# EAGLE design bltthBoard (EAGLE 6.4)
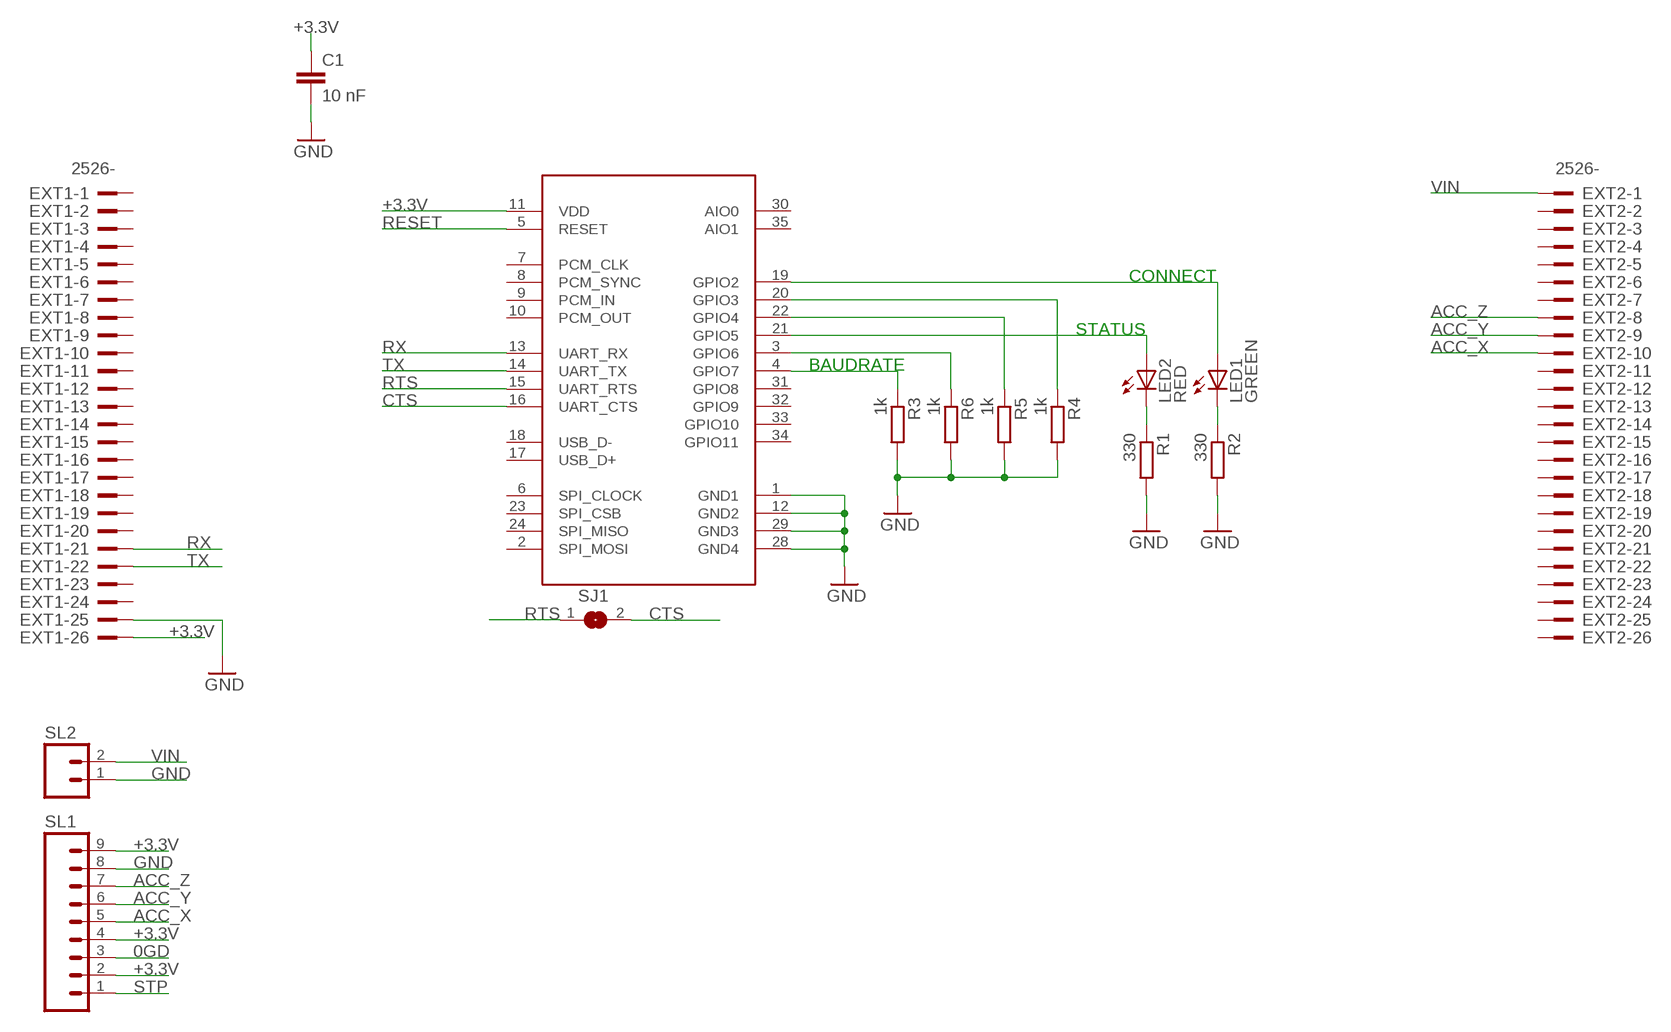
[diagram p0: schematic, sheet 1]

## Parts
C1  10 nF  C-EUC0402  [C0402]
EXT1  2526-  [PAK100/2500-26]
EXT2  2526-  [PAK100/2500-26]
LED1  GREEN  LEDCHIP-LED0805  [CHIP-LED0805]
LED2  RED  LEDCHIP-LED0805  [CHIP-LED0805]
R1  330  R-EU_M0805  [M0805]
R2  330  R-EU_M0805  [M0805]
R3  1k  R-EU_M0805  [M0805]
R4  1k  R-EU_M0805  [M0805]
R5  1k  R-EU_M0805  [M0805]
R6  1k  R-EU_M0805  [M0805]
SJ1  SJ  [SJ]
SL1  M09  [09P]
SL2  M02  [02P]
U$1  U1  BLUETOOTH-RN42  [BLUETOOTH-RN42]

## Nets
0GD: SL1.3
+3.3V: C1.1 EXT1.26 SL1.2 SL1.4 SL1.9 U$1.11(VDD)
ACC_X: EXT2.10 SL1.5
ACC_Y: EXT2.9 SL1.6
ACC_Z: EXT2.8 SL1.7
CTS: SJ1.2 U$1.16(UART_CTS)
GND: C1.2 EXT1.25 R1.2 R2.2 R3.2 R4.2 R5.2 R6.2 SL1.8 SL2.1 U$1.1(GND1) U$1.12(GND2) U$1.28(GND4) U$1.29(GND3)
N$1: LED2.A U$1.21(GPIO5)
N$2: LED1.C R2.1
N$3: LED2.C R1.1
N$4: R3.1 U$1.4(GPIO7)
N$5: R4.1 U$1.20(GPIO3)
N$6: R5.1 U$1.22(GPIO4)
N$7: R6.1 U$1.3(GPIO6)
RESET: U$1.5(RESET)
RTS: SJ1.1 U$1.15(UART_RTS)
RX: EXT1.21 U$1.13(UART_RX)
STATUS: LED1.A U$1.19(GPIO2)
STP: SL1.1
TX: EXT1.22 U$1.14(UART_TX)
VIN: EXT2.1 SL2.2
Unconnected: EXT1.1 EXT1.2 EXT1.3 EXT1.4 EXT1.5 EXT1.6 EXT1.7 EXT1.8 EXT1.9 EXT1.10 EXT1.11 EXT1.12 EXT1.13 EXT1.14 EXT1.15 EXT1.16 EXT1.17 EXT1.18 EXT1.19 EXT1.20 EXT1.23 EXT1.24 EXT2.2 EXT2.3 EXT2.4 EXT2.5 EXT2.6 EXT2.7 EXT2.11 EXT2.12 EXT2.13 EXT2.14 EXT2.15 EXT2.16 EXT2.17 EXT2.18 EXT2.19 EXT2.20 EXT2.21 EXT2.22 EXT2.23 EXT2.24 EXT2.25 EXT2.26 U$1.2(SPI_MOSI) U$1.6(SPI_CLOCK) U$1.7(PCM_CLK) U$1.8(PCM_SYNC) U$1.9(PCM_IN) U$1.10(PCM_OUT) U$1.17(USB_D+) U$1.18(USB_D-) U$1.23(SPI_CSB) U$1.24(SPI_MISO) U$1.30(AIO0) U$1.31(GPIO8) U$1.32(GPIO9) U$1.33(GPIO10) U$1.34(GPIO11) U$1.35(AIO1)

## Notes on the sheet
- CONNECT
- STATUS
- BAUDRATE

## Library data of the parts
C1 = resistor:C-EU: CAPACITOR, European symbol
EXT1 EXT2 = con-3m:2526-: 3M (TM) Pak 100 4-Wall Header Source: 3M; OC_FARNELL: unknown; OC_NEWARK: unknown
LED1 LED2 = led:LED: LED OSRAM: - CHIPLED LG R971, LG N971, LY N971, LG Q971, LY Q971, LO R971, LY R971 LH N974, LH R974 LS Q976, LO Q976, LY Q976 LO Q996 - Hyper CHIPLED LW Q18S LB Q993, LB Q99A, LB R99A - SideLED LS A670, LO A670, LY A670, LG A670, LP A670 LB A673, LV A673, LT A673, LW A673 LH A674 LY A675 LS A676, LA A676, LO A676, LY A676, LW A676 LS A679, LY A679, LG A679 - Hyper Micro SIDELED® LS Y876, LA Y876, LO Y876, LY Y876 LT Y87S - SmartLED LW L88C, LW L88S LB L89C, LB L89S, LG L890 LS L89K, LO L89K, LY L89K LS L896, LA L896, LO L896, LY L896 - TOPLED LS T670, LO T670, LY T670, LG T670, LP T670 LSG T670, LSP T670, LSY T670, LOP T670, LYG T670 LG T671, LOG T671, LSG T671 LB T673, LV T673, LT T673, LW T673 LH T674 LS T676, LA T676, LO T676, LY T676, LB T676, LH T676, LSB T676, LW T676 LB T67C, LV T67C, LT T67C, LS T67K, LO T67K, LY T67K, LW E67C LS E67B, LA E67B, LO E67B, LY E67B, LB E67C, LV E67C, LT E67C LW T67C LS T679, LY T679, LG T679 LS T770, LO T770, LY T770, LG T770, LP T770 LB T773, LV T773, LT T773, LW T773 LH T774 LS E675, LA E675, LY E675, LS T675 LS T776, LA T776, LO T776, LY T776, LB T776 LHGB T686 LT T68C, LB T68C - Hyper Mini TOPLED® LB M676 - Mini TOPLED Santana® LG M470 LS M47K, LO M47K, LY M47K Source: http://www.osram.convergy.de LUXEON: - LUMILED® LXK2-PW12-R00, LXK2-PW12-S00, LXK2-PW14-U00, LXK2-PW14-V00 LXK2-PM12-R00, LXK2-PM12-S00, LXK2-PM14-U00 LXK2-PE12-Q00, LXK2-PE12-R00, LXK2-PE12-S00, LXK2-PE14-T00, LXK2-PE14-U00 LXK2-PB12-K00, LXK2-PB12-L00, LXK2-PB12-M00, LXK2-PB14-N00, LXK2-PB14-P00, LXK2-PB14-Q00 LXK2-PR12-L00, LXK2-PR12-M00, LXK2-PR14-Q00, LXK2-PR14-R00 LXK2-PD12-Q00, LXK2-PD12-R00, LXK2-PD12-S00 LXK2-PH12-R00, LXK2-PH12-S00 LXK2-PL12-P00, LXK2-PL12-Q00, LXK2-PL12-R00 Source: www.luxeon.com KINGBRIGHT: KA-3528ASYC Source: www.kingbright.com
R1-R6 = resistor:R-EU_: RESISTOR, European symbol
SJ1 = jumper:SJ: SMD solder JUMPER
SL1 = con-amp-quick:M09: AMP QUICK CONNECTOR; OC_FARNELL: unknown; OC_NEWARK: unknown
SL2 = con-amp-quick:M02: AMP QUICK CONNECTOR; OC_FARNELL: unknown; OC_NEWARK: unknown
U$1 = rn42:BLUETOOTH-RN42

## Board
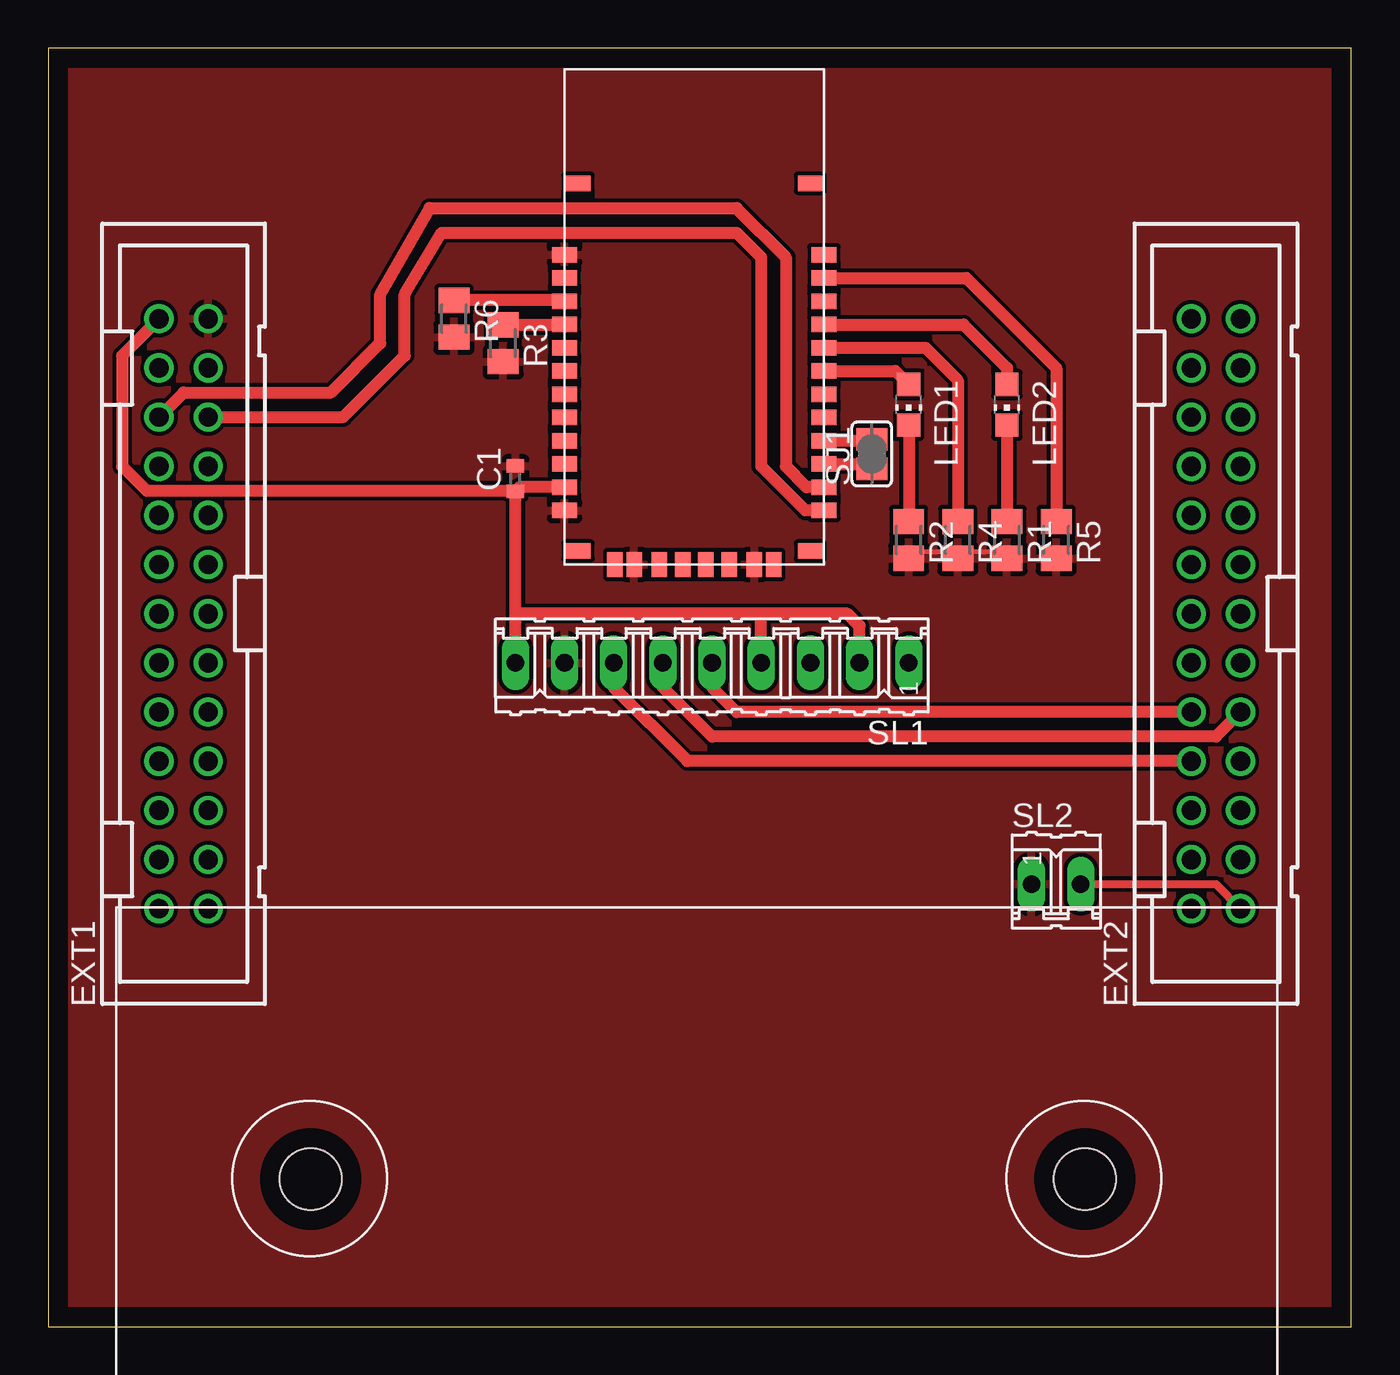
[diagram p1: board, top side]

Size 67.31 x 66.04 mm. Coordinates in mm from the lower left corner, seen from the top.
Outline: 0,0 67.31,0 67.31,66.04 0,66.04 0,0
Copper layers (1*16): Top 0.035mm / dielectric 1.5mm / Bottom 0.035mm
Design rules "default": minimum track width 10mil, minimum drill 24mil, track to track 8mil, track to pad 8mil, pad to pad 8mil, via to via 8mil, smd to smd 8mil, copper to edge 40mil, drill to drill 8mil, minimum pad ring 10mil, minimum via ring 8mil, stop-mask expansion 4mil, vias tented up to drill 0mil, thermal gap 10mil
Holes 3.2 mm at 13.55,7.62 53.55,7.62

### Footprints (pad centres in the part's own frame; a part is rotated, then mirrored left to right if it is on the bottom)
C0402 = smd 0.7 x 0.9: 1 -0.65,0; 2 0.65,0
PAK100/2500-26 = drill 1 pad 1.422: 1 -15.24,-1.27; 2 -15.24,1.27; 3 -12.7,-1.27; 4 -12.7,1.27; 5 -10.16,-1.27; 6 -10.16,1.27; 7 -7.62,-1.27; 8 -7.62,1.27; 9 -5.08,-1.27; 10 -5.08,1.27; 11 -2.54,-1.27; 12 -2.54,1.27; 13 0,-1.27; 14 0,1.27; 15 2.54,-1.27; 16 2.54,1.27; 17 5.08,-1.27; 18 5.08,1.27; 19 7.62,-1.27; 20 7.62,1.27; 21 10.16,-1.27; 22 10.16,1.27; 23 12.7,-1.27; 24 12.7,1.27; 25 15.24,-1.27; 26 15.24,1.27
CHIP-LED0805 = smd 1.2 x 1.2: A 0,-1.05; C 0,1.05
M0805 = smd 1.3 x 1.6: 1 -0.95,0; 2 0.95,0
SJ = smd 1.168 x 1.6: 1 -0.762,0; 2 0.762,0
09P = drill 0.914 long: 1 -10.16,0; 2 -7.62,0; 3 -5.08,0; 4 -2.54,0; 5 0,0; 6 2.54,0; 7 5.08,0; 8 7.62,0; 9 10.16,0
02P = drill 0.914 long: 1 -1.27,0; 2 1.27,0
BLUETOOTH-RN42 = smd 1.3 x 0.8: 1 0,16; 2 0,14.8; 3 0,13.6; 4 0,12.4; 5 0,11.2; 6 0,10; 7 0,8.8; 8 0,7.6; 9 0,6.4; 10 0,5.2; 11 0,4; 12 0,2.8; 13 13.4,2.8; 14 13.4,4; 15 13.4,5.2; 16 13.4,6.4; 17 13.4,7.6; 18 13.4,8.8; 19 13.4,10; 20 13.4,11.2; 21 13.4,12.4; 22 13.4,14.8; 23 13.4,16; 24 13.4,13.6; P$1 12.7,0.7; P$2 0.7,0.7; P$3 0.7,19.7; P$4 12.7,19.7 | smd 0.8 x 1.3: 28 9.8,0; 29 3.6,0; 30 10.8,0; 31 8.5,0; 32 7.3,0; 33 6.1,0; 34 4.9,0; 35 2.6,0

### Placement (x,y rotation side)
C1  24.13,43.81 90 top
EXT1  6.99,36.83 90 top
EXT2  60.33,36.83 90 top
LED1  44.45,47.62 180 top
LED2  49.53,47.62 180 top
R1  49.53,40.64 270 top
R2  44.45,40.64 270 top
R3  23.5,50.8 270 top
R4  46.99,40.64 270 top
R5  52.07,40.64 270 top
R6  20.95,52.07 270 top
SJ1  42.55,45.09 90 top
SL1  34.29,34.29 180 top
SL2  52.07,22.86 0 top
U$1  26.67,39.37 0 top
U$3  [SUPPORTDEPLIELR6]  63.5,-6.35 180 top  (outside the outline)

### Tracks (layer width: path | path; a pad name or v marks a point on that pad's centre or on a via)
+3.3V
  Top 0.61: U$1.11 24.34,43.37 C1.1 | EXT1.26 3.81,50.16 3.81,44.45 5.08,43.18 24.11,43.18 C1.1 | SL1.9 24.13,36.83 | 24.13,36.83 C1.1 | SL1.2 41.91,36.2 41.27,36.83 36.83,36.83 | 36.83,36.83 24.13,36.83 | SL1.4 36.83,36.83
ACC_X
  Top 0.61: EXT2.10 35.56,31.75 34.29,33.02 SL1.5
ACC_Y
  Top 0.61: EXT2.9 60.33,30.48 34.29,30.48 31.75,33.02 SL1.6
ACC_Z
  Top 0.61: EXT2.8 33.02,29.21 29.21,33.02 SL1.7
CTS
  Top 0.254: 43.18,45.72 SJ1.2
  Top 0.61: U$1.16 42.47,45.77 SJ1.2
GND
  Top 0.254: R2.2 45.09,40.01 48.9,40.01 R1.2
  pour Top: 0,0 67.31,0 67.31,66.04 0,66.04
N$1
  Top 0.61: U$1.21 47.29,51.77 49.53,49.53 LED2.A
N$2
  Top 0.61: LED1.C R2.1
N$3
  Top 0.61: LED2.C R1.1
N$4
  Top 0.406: 26.65,51.75 U$1.4
  Top 0.61: 26.65,51.75 R3.1
N$5
  Top 0.61: U$1.20 45.31,50.57 46.99,48.9 R4.1
N$6
  Top 0.61: U$1.22 47.43,54.17 52.07,49.53 R5.1
N$7
  Top 0.406: 26.62,53.02 U$1.3
  Top 0.61: 26.62,53.02 R6.1
RTS
  Top 0.254: 43.18,44.45 SJ1.1
  Top 0.61: U$1.15 42.3,44.57 SJ1.1
RX
  Top 0.61: EXT1.21 15.24,46.99 18.41,50.16 18.41,53.34 20.32,56.52 35.56,56.52 36.83,55.24 36.83,44.45 39.11,42.17 U$1.13
STATUS
  Top 0.61: U$1.19 43.76,49.37 LED1.A
TX
  Top 0.61: EXT1.22 6.99,48.26 14.61,48.26 17.14,50.8 17.14,53.34 19.68,57.78 35.56,57.78 38.1,55.24 38.1,44.45 39.18,43.37 U$1.14
VIN
  Top 0.406: SL2.2 60.33,22.86 EXT2.1